# Altium schematic sheet CPU_Peripherals.SchDoc
size 594 x 420 mm; SheetNumber: 11; SheetTotal: 16
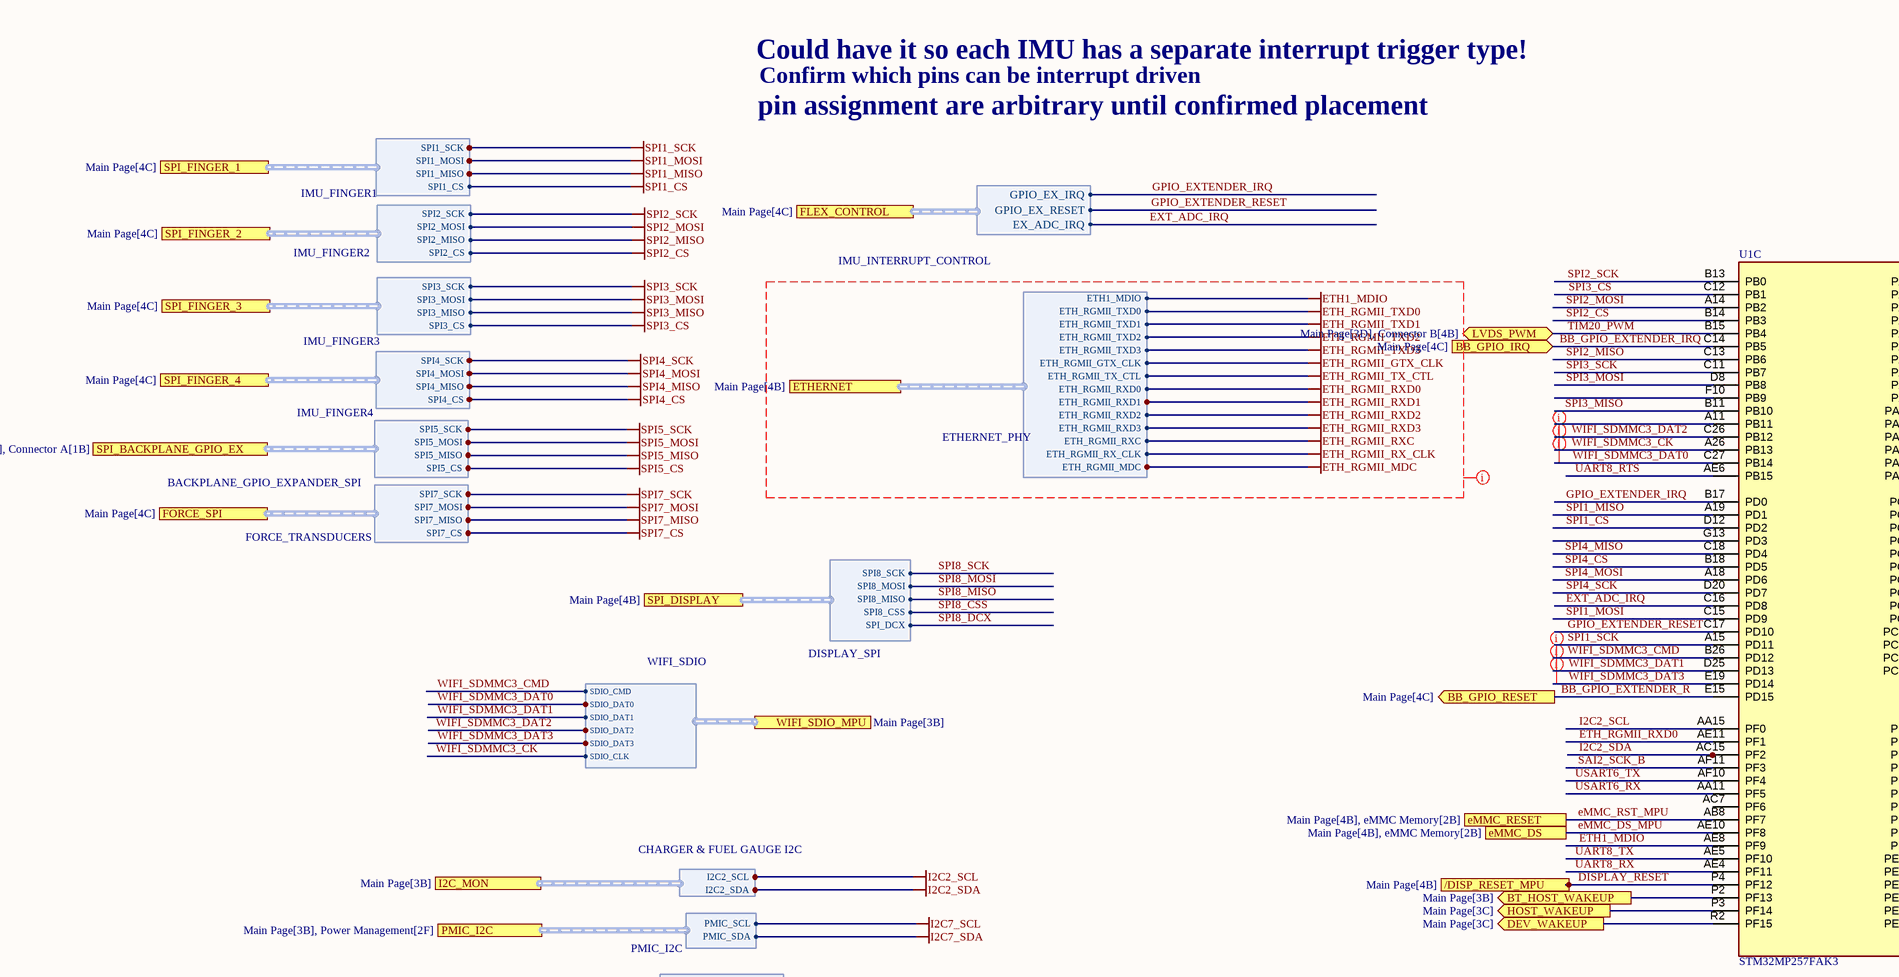
[diagram p0: CPU_Peripherals.SchDoc, top left]
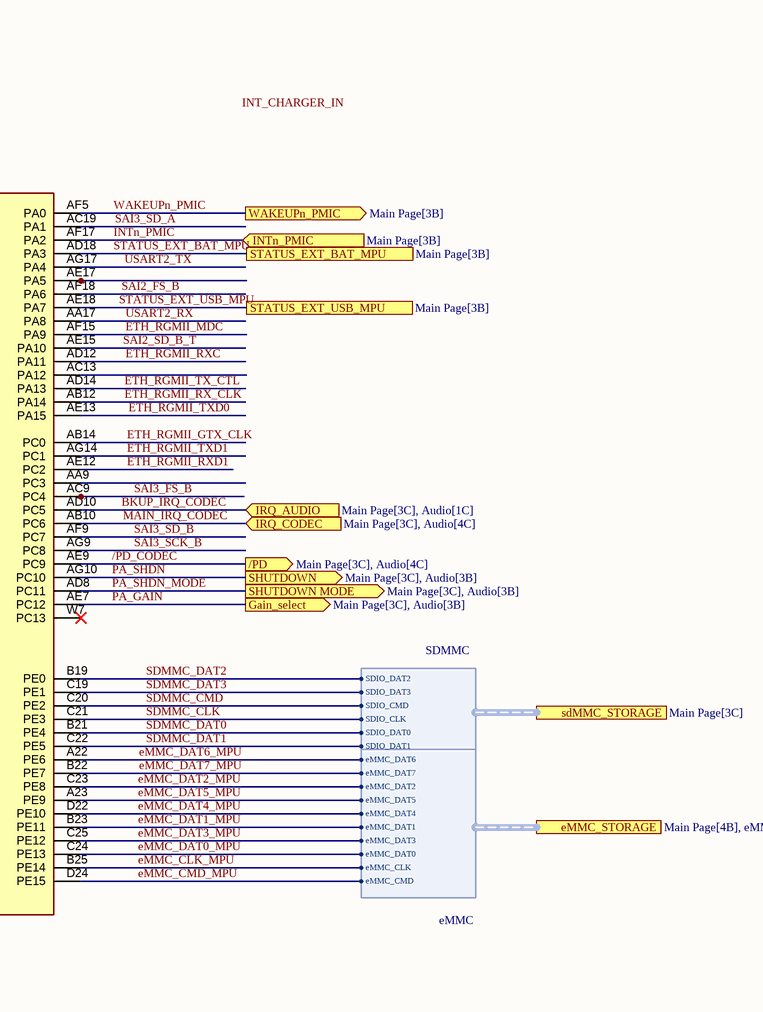
[diagram p1: CPU_Peripherals.SchDoc, top right]
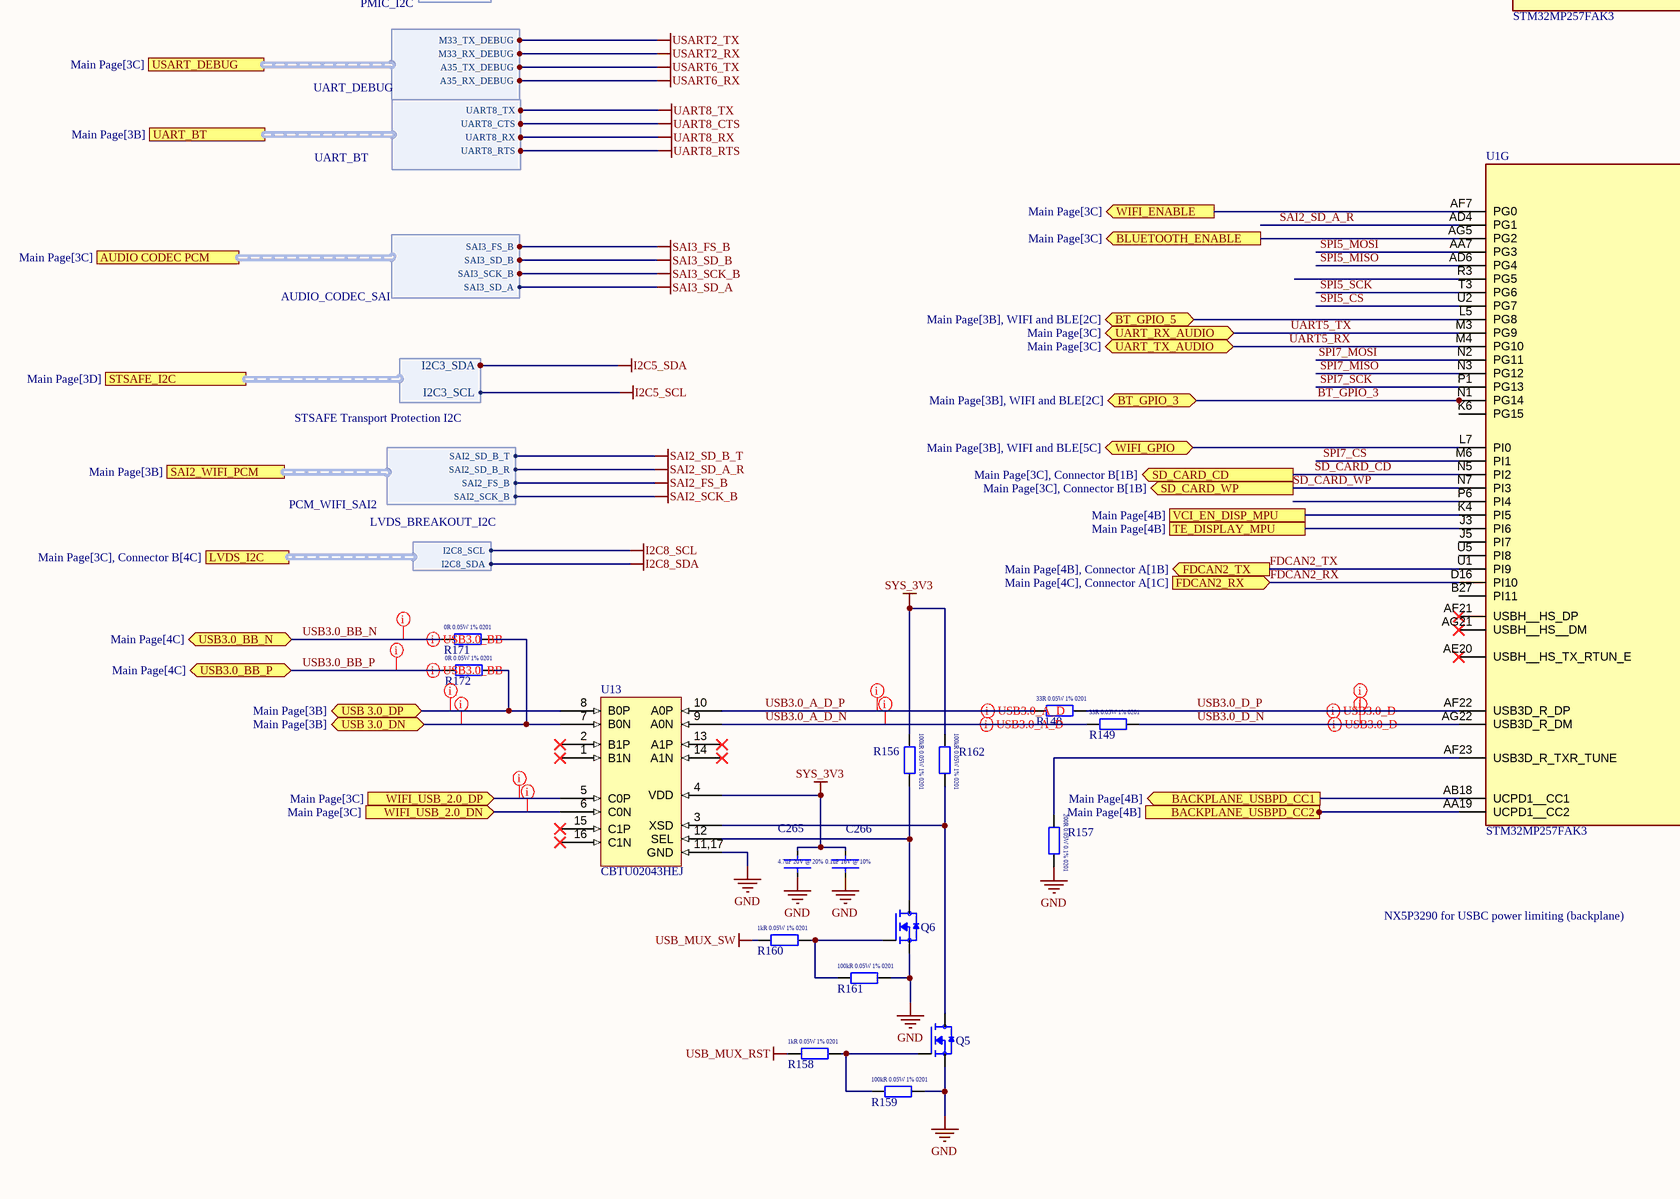
[diagram p2: CPU_Peripherals.SchDoc, bottom left]
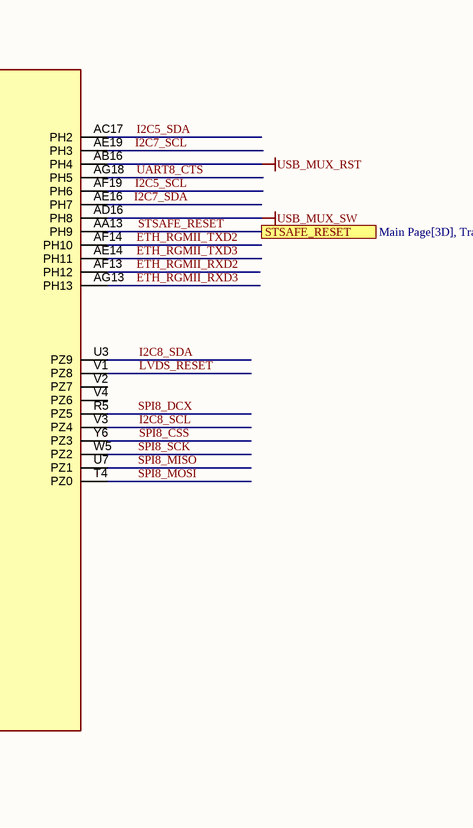
[diagram p3: CPU_Peripherals.SchDoc, bottom right]

## Parts
C265  4.7uF  [CAPC1005X06L]  (value not drawn)
C266  0.1uF  [CAPC0603X03L]  (value not drawn)
Q5  SSM3K15ACT,L3F  [SSM3K15ACT]  (value not drawn)
Q6  SSM3K15ACT,L3F  [SSM3K15ACT]  (value not drawn)
R148  ERJ-1GNF33R0C  [RESC0603X03L]  (value not drawn)
R149  ERJ-1GNF33R0C  [RESC0603X03L]  (value not drawn)
R156  ERJ-1GNF1003C  [RESC0603X03L]  (value not drawn)
R157  ERA-1AEB201C  [RESC0603X03L]  (value not drawn)
R158  ERJ-1GNF1001C  [RESC0603X03L]  (value not drawn)
R159  ERJ-1GNF1003C  [RESC0603X03L]  (value not drawn)
R160  ERJ-1GNF1001C  [RESC0603X03L]  (value not drawn)
R161  ERJ-1GNF1003C  [RESC0603X03L]  (value not drawn)
R162  ERJ-1GNF1003C  [RESC0603X03L]  (value not drawn)
R171  ERJ-1GN0R00C  [RESC0603X03L]  (value not drawn)
R172  ERJ-1GN0R00C  [RESC0603X03L]  (value not drawn)
U1  STM32MP257FAK3  [STM32MP257FAK3]  (parts C,G of 7)
U13  CBTU02043HEJ  [CBTU02043HEJ]

## Ports
/DISP_RESET_MPU (out, see Main Page[4B]), /PD (out, see Main Page[3C], Audio[4C]), AUDIO CODEC PCM (harness AUDIO_CODEC_SAI, see Main Page[3C]), BACKPLANE_USBPD_CC1 (out, see Main Page[4B]), BACKPLANE_USBPD_CC2 (out, see Main Page[4B]), BB_GPIO_IRQ (in, see Main Page[4C]), BB_GPIO_RESET (out, see Main Page[4C]), BLUETOOTH_ENABLE (out, see Main Page[3C]), BT_GPIO_3 (bidir, see Main Page[3B], WIFI and BLE[2C]), BT_GPIO_5 (bidir, see Main Page[3B], WIFI and BLE[2C]), BT_HOST_WAKEUP (out, see Main Page[3B]), DEV_WAKEUP (out, see Main Page[3C]), eMMC_DS (see Main Page[4B], eMMC Memory[2B]), eMMC_RESET (see Main Page[4B], eMMC Memory[2B]), eMMC_STORAGE (harness eMMC, see Main Page[4B], eMMC Memory[1B]), ETHERNET (harness ETHERNET_PHY, see Main Page[4B]), FDCAN2_RX (in, see Main Page[4C], Connector A[1C]), FDCAN2_TX (out, see Main Page[4B], Connector A[1B]), FLEX_CONTROL (harness IMU_INTERRUPT_CONTROL, see Main Page[4C]), FORCE_SPI (harness FORCE_TRANSDUCERS, see Main Page[4C]), Gain_select (out, see Main Page[3C], Audio[3B]), HOST_WAKEUP (out, see Main Page[3C]), I2C_MON (harness CHARGER & FUEL GAUGE I2C, see Main Page[3B]), INTn_PMIC (in, see Main Page[3B]), IRQ_AUDIO (in, see Main Page[3C], Audio[1C]), IRQ_CODEC (in, see Main Page[3C], Audio[4C]), LVDS_I2C (harness LVDS_BREAKOUT_I2C, see Main Page[3C], Connector B[4C]), LVDS_PWM (bidir, see Main Page[3D], Connector B[4B]), PMIC_I2C (harness PMIC_I2C, see Main Page[3B], Power Management[2F]), SAI2_WIFI_PCM (harness PCM_WIFI_SAI2, see Main Page[3B]), SD_CARD_CD (out, see Main Page[3C], Connector B[1B]), SD_CARD_WP (out, see Main Page[3C], Connector B[1B]), sdMMC_STORAGE (harness SDMMC, see Main Page[3C]), SHUTDOWN (out, see Main Page[3C], Audio[3B]), SHUTDOWN MODE (out, see Main Page[3C], Audio[3B]), SPI_BACKPLANE_GPIO_EX (harness BACKPLANE_GPIO_EXPANDER_SPI, see Main Page[4B], Connector A[1B]), SPI_DISPLAY (harness DISPLAY_SPI, see Main Page[4B]), SPI_FINGER_1 (harness IMU_FINGER1, see Main Page[4C]), SPI_FINGER_2 (harness IMU_FINGER2, see Main Page[4C]), SPI_FINGER_3 (harness IMU_FINGER3, see Main Page[4C]), SPI_FINGER_4 (harness IMU_FINGER4, see Main Page[4C]), STATUS_EXT_BAT_MPU (see Main Page[3B]), STATUS_EXT_USB_MPU (see Main Page[3B]), STSAFE_I2C (harness STSAFE Transport Protection I2C, see Main Page[3D]), STSAFE_RESET (see Main Page[3D], Transport Layer Security[3B]), TE_DISPLAY_MPU (see Main Page[4B]), UART_BT (harness UART_BT, see Main Page[3B]), UART_RX_AUDIO (bidir, see Main Page[3C]), UART_TX_AUDIO (bidir, see Main Page[3C]), USART_DEBUG (harness UART_DEBUG, see Main Page[3C]), USB3.0_BB_N (bidir, see Main Page[4C]), USB3.0_BB_P (bidir, see Main Page[4C]), USB 3.0_DN (bidir, see Main Page[3B]), USB 3.0_DP (bidir, see Main Page[3B]), VCI_EN_DISP_MPU (see Main Page[4B]), WAKEUPn_PMIC (out, see Main Page[3B]), WIFI_ENABLE (out, see Main Page[3C]), WIFI_GPIO (bidir, see Main Page[3B], WIFI and BLE[5C]), WIFI_SDIO_MPU (harness WIFI_SDIO, see Main Page[3B]), WIFI_USB_2.0_DN (in, see Main Page[3C]), WIFI_USB_2.0_DP (in, see Main Page[3C])

## Harnesses
eMMC: eMMC_CLK, eMMC_CMD, eMMC_DAT0, eMMC_DAT1, eMMC_DAT2, eMMC_DAT3, eMMC_DAT4, eMMC_DAT5, eMMC_DAT6, eMMC_DAT7
SDMMC: SDIO_DAT2, SDIO_DAT3, SDIO_DAT0, SDIO_DAT1, SDIO_CMD, SDIO_CLK
WIFI_SDIO: SDIO_DAT2, SDIO_DAT3, SDIO_DAT0, SDIO_DAT1, SDIO_CMD, SDIO_CLK
UART_DEBUG: M33_TX_DEBUG, M33_RX_DEBUG, A35_TX_DEBUG, A35_RX_DEBUG
UART_BT: UART8_TX, UART8_CTS, UART8_RX, UART8_RTS
ETHERNET_PHY: ETH_RGMII_GTX_CLK, ETH_RGMII_TX_CTL, ETH_RGMII_RXD0, ETH_RGMII_RXD1, ETH_RGMII_TXD0, ETH_RGMII_TXD1, ETH_RGMII_TXD2, ETH_RGMII_TXD3, ETH_RGMII_RXD2, ETH_RGMII_RXD3, ETH_RGMII_RXC, ETH_RGMII_RX_CLK, ETH_RGMII_MDC, ETH1_MDIO
AUDIO_CODEC_SAI: SAI3_FS_B, SAI3_SD_B, SAI3_SCK_B, SAI3_SD_A
IMU_FINGER1: SPI1_SCK, SPI1_MOSI, SPI1_MISO, SPI1_CS
IMU_FINGER2: SPI2_SCK, SPI2_MOSI, SPI2_MISO, SPI2_CS
IMU_FINGER3: SPI3_SCK, SPI3_MOSI, SPI3_MISO, SPI3_CS
IMU_FINGER4: SPI4_SCK, SPI4_MOSI, SPI4_MISO, SPI4_CS
BACKPLANE_GPIO_EXPANDER_SPI: SPI5_SCK, SPI5_MOSI, SPI5_MISO, SPI5_CS
FORCE_TRANSDUCERS: SPI7_SCK, SPI7_MOSI, SPI7_MISO, SPI7_CS
CHARGER & FUEL GAUGE I2C: I2C2_SCL, I2C2_SDA
PCM_WIFI_SAI2: SAI2_SD_B_R, SAI2_FS_B, SAI2_SCK_B, SAI2_SD_B_T
DISPLAY_SPI: SPI8_SCK, SPI8_MOSI, SPI8_MISO, SPI_DCX, SPI8_CSS
PMIC_I2C: PMIC_SCL, PMIC_SDA
STSAFE Transport Protection I2C: I2C3_SCL, I2C3_SDA
LVDS_BREAKOUT_I2C: I2C8_SCL, I2C8_SDA
IMU_INTERRUPT_CONTROL: GPIO_EX_IRQ, GPIO_EX_RESET, EX_ADC_IRQ

## Nets
ETH1_MDIO: U1.AE8(PF9) ; port ETHERNET.ETH1_MDIO
ETH_RGMII_GTX_CLK: U1.AB14(PC0) ; port ETHERNET.ETH_RGMII_GTX_CLK
ETH_RGMII_MDC: U1.AF15(PA9) ; port ETHERNET.ETH_RGMII_MDC
ETH_RGMII_RX_CLK: U1.AB12(PA14) ; port ETHERNET.ETH_RGMII_RX_CLK
ETH_RGMII_RXC: U1.AD12(PA11) ; port ETHERNET.ETH_RGMII_RXC
ETH_RGMII_RXD0: U1.AE11(PF1) ; port ETHERNET.ETH_RGMII_RXD0
ETH_RGMII_RXD1: U1.AE12(PC2) ; port ETHERNET.ETH_RGMII_RXD1
ETH_RGMII_RXD2: U1.AF13(PH12) ; port ETHERNET.ETH_RGMII_RXD2
ETH_RGMII_RXD3: U1.AG13(PH13) ; port ETHERNET.ETH_RGMII_RXD3
ETH_RGMII_TX_CTL: U1.AD14(PA13) ; port ETHERNET.ETH_RGMII_TX_CTL
ETH_RGMII_TXD0: U1.AE13(PA15) ; port ETHERNET.ETH_RGMII_TXD0
ETH_RGMII_TXD1: U1.AG14(PC1) ; port ETHERNET.ETH_RGMII_TXD1
ETH_RGMII_TXD2: U1.AF14(PH10) ; port ETHERNET.ETH_RGMII_TXD2
ETH_RGMII_TXD3: U1.AE14(PH11) ; port ETHERNET.ETH_RGMII_TXD3
GND: C265.1 C266.1 Q5.3(S) Q6.3(S) R157.2 R159.2 R161.2 U13.11,17(GND)
I2C2_SCL: U1.AA15(PF0) ; port I2C_MON.I2C2_SCL
I2C2_SDA: U1.AC15(PF2) ; port I2C_MON.I2C2_SDA
I2C5_SCL: U1.AF19(PH6) ; port STSAFE_I2C.I2C3_SCL
I2C5_SDA: U1.AC17(PH2) ; port STSAFE_I2C.I2C3_SDA
I2C7_SCL: U1.AE19(PH3) ; port PMIC_I2C.PMIC_SCL
I2C7_SDA: U1.AE16(PH7) ; port PMIC_I2C.PMIC_SDA
I2C8_SCL: U1.V3(PZ4) ; port LVDS_I2C.I2C8_SCL
I2C8_SDA: U1.U3(PZ9) ; port LVDS_I2C.I2C8_SDA
SAI2_FS_B: U1.AF18(PA6) ; port SAI2_WIFI_PCM.SAI2_FS_B
SAI2_SCK_B: U1.AF11(PF3) ; port SAI2_WIFI_PCM.SAI2_SCK_B
SAI2_SD_A_R: U1.AD4(PG1) ; port SAI2_WIFI_PCM.SAI2_SD_B_R
SAI2_SD_B_T: U1.AE15(PA10) ; port SAI2_WIFI_PCM.SAI2_SD_B_T
SAI3_FS_B: U1.AC9(PC4) ; port AUDIO CODEC PCM.SAI3_FS_B
SAI3_SCK_B: U1.AG9(PC8) ; port AUDIO CODEC PCM.SAI3_SCK_B
SAI3_SD_A: U1.AC19(PA1) ; port AUDIO CODEC PCM.SAI3_SD_A
SAI3_SD_B: U1.AF9(PC7) ; port AUDIO CODEC PCM.SAI3_SD_B
SPI1_CS: U1.D12(PD2) ; port SPI_FINGER_1.SPI1_CS
SPI1_MISO: U1.A19(PD1) ; port SPI_FINGER_1.SPI1_MISO
SPI1_MOSI: U1.C15(PD9) ; port SPI_FINGER_1.SPI1_MOSI
SPI1_SCK: U1.A15(PD11) ; port SPI_FINGER_1.SPI1_SCK
SPI2_CS: U1.B14(PB3) ; port SPI_FINGER_2.SPI2_CS
SPI2_MISO: U1.C13(PB6) ; port SPI_FINGER_2.SPI2_MISO
SPI2_MOSI: U1.A14(PB2) ; port SPI_FINGER_2.SPI2_MOSI
SPI2_SCK: U1.B13(PB0) ; port SPI_FINGER_2.SPI2_SCK
SPI3_CS: U1.C12(PB1) ; port SPI_FINGER_3.SPI3_CS
SPI3_MISO: U1.B11(PB10) ; port SPI_FINGER_3.SPI3_MISO
SPI3_MOSI: U1.D8(PB8) ; port SPI_FINGER_3.SPI3_MOSI
SPI3_SCK: U1.C11(PB7) ; port SPI_FINGER_3.SPI3_SCK
SPI4_CS: U1.B18(PD5) ; port SPI_FINGER_4.SPI4_CS
SPI4_MISO: U1.C18(PD4) ; port SPI_FINGER_4.SPI4_MISO
SPI4_MOSI: U1.A18(PD6) ; port SPI_FINGER_4.SPI4_MOSI
SPI4_SCK: U1.D20(PD7) ; port SPI_FINGER_4.SPI4_SCK
SPI5_CS: U1.U2(PG7) ; port SPI_BACKPLANE_GPIO_EX.SPI5_CS
SPI5_MISO: U1.AD6(PG4) ; port SPI_BACKPLANE_GPIO_EX.SPI5_MISO
SPI5_MOSI: U1.AA7(PG3) ; port SPI_BACKPLANE_GPIO_EX.SPI5_MOSI
SPI5_SCK: U1.T3(PG6) ; port SPI_BACKPLANE_GPIO_EX.SPI5_SCK
SPI7_CS: U1.M6(PI1) ; port FORCE_SPI.SPI7_CS
SPI7_MISO: U1.N3(PG12) ; port FORCE_SPI.SPI7_MISO
SPI7_MOSI: U1.N2(PG11) ; port FORCE_SPI.SPI7_MOSI
SPI7_SCK: U1.P1(PG13) ; port FORCE_SPI.SPI7_SCK
SYS_3V3: C265.2 C266.2 R156.1 R162.1 U13.4(VDD)
UART8_CTS: U1.AG18(PH5) ; port UART_BT.UART8_CTS
UART8_RTS: U1.AE6(PB15) ; port UART_BT.UART8_RTS
UART8_RX: U1.AE4(PF11) ; port UART_BT.UART8_RX
UART8_TX: U1.AE5(PF10) ; port UART_BT.UART8_TX
USART2_RX: U1.AA17(PA8) ; port USART_DEBUG.M33_RX_DEBUG
USART2_TX: U1.AG17(PA4) ; port USART_DEBUG.M33_TX_DEBUG
USART6_RX: U1.AA11(PF5) ; port USART_DEBUG.A35_RX_DEBUG
USART6_TX: U1.AF10(PF4) ; port USART_DEBUG.A35_TX_DEBUG
USB_MUX_RST: R158.1 U1.AB16(PH4)
USB_MUX_SW: R160.1 U1.AD16(PH8)
/PD_CODEC: U1.AE9(PC9) ; port /PD
BACKPLANE_USBPD_CC1: U1.AB18(UCPD1__CC1) ; port BACKPLANE_USBPD_CC1
BACKPLANE_USBPD_CC2: U1.AA19(UCPD1__CC2) ; port BACKPLANE_USBPD_CC2
BB_GPIO_EXTENDER_IRQ: U1.C14(PB5) ; port BB_GPIO_IRQ
BB_GPIO_EXTENDER_R: U1.E15(PD15) ; port BB_GPIO_RESET
BKUP_IRQ_CODEC: U1.AD10(PC5) ; port IRQ_AUDIO
BLUETOOTH_ENABLE: U1.AG5(PG2) ; port BLUETOOTH_ENABLE
BT_GPIO_3: U1.N1(PG14) ; port BT_GPIO_3
BT_GPIO_5: U1.L5(PG8) ; port BT_GPIO_5
BT_HOST_WAKEUP: U1.P2(PF13) ; port BT_HOST_WAKEUP
DEV_WAKEUP: U1.R2(PF15) ; port DEV_WAKEUP
DISPLAY_RESET: U1.P4(PF12) ; port /DISP_RESET_MPU
eMMC_CLK_MPU: U1.B25(PE14) ; port eMMC_STORAGE.eMMC_CLK
eMMC_CMD_MPU: U1.D24(PE15) ; port eMMC_STORAGE.eMMC_CMD
eMMC_DAT0_MPU: U1.C24(PE13) ; port eMMC_STORAGE.eMMC_DAT0
eMMC_DAT1_MPU: U1.B23(PE11) ; port eMMC_STORAGE.eMMC_DAT1
eMMC_DAT2_MPU: U1.C23(PE8) ; port eMMC_STORAGE.eMMC_DAT2
eMMC_DAT3_MPU: U1.C25(PE12) ; port eMMC_STORAGE.eMMC_DAT3
eMMC_DAT4_MPU: U1.D22(PE10) ; port eMMC_STORAGE.eMMC_DAT4
eMMC_DAT5_MPU: U1.A23(PE9) ; port eMMC_STORAGE.eMMC_DAT5
eMMC_DAT6_MPU: U1.A22(PE6) ; port eMMC_STORAGE.eMMC_DAT6
eMMC_DAT7_MPU: U1.B22(PE7) ; port eMMC_STORAGE.eMMC_DAT7
eMMC_DS_MPU: U1.AE10(PF8) ; port eMMC_DS
eMMC_RST_MPU: U1.AB8(PF7) ; port eMMC_RESET
EXT_ADC_IRQ: U1.C16(PD8) ; port FLEX_CONTROL.EX_ADC_IRQ
FDCAN2_RX: U1.D16(PI10) ; port FDCAN2_RX
FDCAN2_TX: U1.U1(PI9) ; port FDCAN2_TX
GPIO_EXTENDER_IRQ: U1.B17(PD0) ; port FLEX_CONTROL.GPIO_EX_IRQ
GPIO_EXTENDER_RESET: U1.C17(PD10) ; port FLEX_CONTROL.GPIO_EX_RESET
HOST_WAKEUP: U1.P3(PF14) ; port HOST_WAKEUP
INTn_PMIC: U1.AF17(PA2) ; port INTn_PMIC
LVDS_RESET: U1.V1(PZ8)
MAIN_IRQ_CODEC: U1.AB10(PC6) ; port IRQ_CODEC
PA_GAIN: U1.AE7(PC12) ; port Gain_select
PA_SHDN: U1.AG10(PC10) ; port SHUTDOWN
PA_SHDN_MODE: U1.AD8(PC11) ; port SHUTDOWN MODE
SD_CARD_CD: U1.N5(PI2) ; port SD_CARD_CD
SD_CARD_WP: U1.N7(PI3) ; port SD_CARD_WP
SDMMC_CLK: U1.C21(PE3) ; port sdMMC_STORAGE.SDIO_CLK
SDMMC_CMD: U1.C20(PE2) ; port sdMMC_STORAGE.SDIO_CMD
SDMMC_DAT0: U1.B21(PE4) ; port sdMMC_STORAGE.SDIO_DAT0
SDMMC_DAT1: U1.C22(PE5) ; port sdMMC_STORAGE.SDIO_DAT1
SDMMC_DAT2: U1.B19(PE0) ; port sdMMC_STORAGE.SDIO_DAT2
SDMMC_DAT3: U1.C19(PE1) ; port sdMMC_STORAGE.SDIO_DAT3
SPI8_CSS: U1.Y6(PZ3) ; port SPI_DISPLAY.SPI8_CSS
SPI8_DCX: U1.R5(PZ5) ; port SPI_DISPLAY.SPI_DCX
SPI8_MISO: U1.U7(PZ1) ; port SPI_DISPLAY.SPI8_MISO
SPI8_MOSI: U1.T4(PZ0) ; port SPI_DISPLAY.SPI8_MOSI
SPI8_SCK: U1.W5(PZ2) ; port SPI_DISPLAY.SPI8_SCK
STATUS_EXT_BAT_MPU: U1.AD18(PA3) ; port STATUS_EXT_BAT_MPU
STATUS_EXT_USB_MPU: U1.AE18(PA7) ; port STATUS_EXT_USB_MPU
STSAFE_RESET: U1.AA13(PH9) ; port STSAFE_RESET
TE_DISPLAY_MPU: U1.J3(PI6) ; port TE_DISPLAY_MPU
TIM20_PWM: U1.B15(PB4) ; port LVDS_PWM
UART5_RX: U1.M4(PG10) ; port UART_TX_AUDIO
UART5_TX: U1.M3(PG9) ; port UART_RX_AUDIO
USB3.0_A_D_N: R149.1 U13.9(A0N)
USB3.0_A_D_P: R148.1 U13.10(A0P)
USB3.0_BB_N: R171.1 ; port USB3.0_BB_N
USB3.0_BB_P: R172.1 ; port USB3.0_BB_P
USB3.0_D_N: R149.2 U1.AG22(USB3D_R_DM)
USB3.0_D_P: R148.2 U1.AF22(USB3D_R_DP)
USB 3.0_DN: R171.2 U13.7(B0N) ; port USB 3.0_DN
USB 3.0_DP: R172.2 U13.8(B0P) ; port USB 3.0_DP
VCI_EN_DISP_MPU: U1.K4(PI5) ; port VCI_EN_DISP_MPU
WAKEUPn_PMIC: U1.AF5(PA0) ; port WAKEUPn_PMIC
WIFI_ENABLE: U1.AF7(PG0) ; port WIFI_ENABLE
WIFI_GPIO: U1.L7(PI0) ; port WIFI_GPIO
WIFI_SDMMC3_CK: U1.A26(PB13) ; port WIFI_SDIO_MPU.SDIO_CLK
WIFI_SDMMC3_CMD: U1.B26(PD12) ; port WIFI_SDIO_MPU.SDIO_CMD
WIFI_SDMMC3_DAT0: U1.C27(PB14) ; port WIFI_SDIO_MPU.SDIO_DAT0
WIFI_SDMMC3_DAT1: U1.D25(PD13) ; port WIFI_SDIO_MPU.SDIO_DAT1
WIFI_SDMMC3_DAT2: U1.C26(PB12) ; port WIFI_SDIO_MPU.SDIO_DAT2
WIFI_SDMMC3_DAT3: U1.E19(PD14) ; port WIFI_SDIO_MPU.SDIO_DAT3
WIFI_USB_2.0_DN: U13.6(C0N) ; port WIFI_USB_2.0_DN
WIFI_USB_2.0_DP: U13.5(C0P) ; port WIFI_USB_2.0_DP
NetQ5_1: Q5.1(G) R158.2 R159.1
NetQ5_2: Q5.2(D) R162.2 U13.3(XSD)
NetQ6_1: Q6.1(G) R160.2 R161.1
NetQ6_2: Q6.2(D) R156.2 U13.12(SEL)
NetR157_1: R157.1 U1.AF23(USB3D_R_TXR_TUNE)

Not connected (* = marked no-connect by the designer): U1 A11(PB11) AA9(PC3) AC7(PF6) AC13(PA12) AE17(PA5) AE20(USBH__HS_TX_RTUN_E)* AF21(USBH__HS_DP)* AG21(USBH__HS__DM)* B27(PI11) F10(PB9) G13(PD3) J5(PI7) K6(PG15) P6(PI4) R3(PG5) U5(PI8) V2(PZ7) V4(PZ6) W7(PC13)*; U13 1(B1N)* 2(B1P)* 13(A1P)* 14(A1N)* 15(C1P)* 16(C1N)*

## Layout directives
net class WiFi & BlueTooth: WIFI_SDMMC3_CK, WIFI_SDMMC3_CMD, WIFI_SDMMC3_DAT0, WIFI_SDMMC3_DAT1, WIFI_SDMMC3_DAT2, WIFI_SDMMC3_DAT3
differential pair: USB3.0_A_D_N, USB3.0_A_D_P, USB3.0_BB_N, USB3.0_BB_P, USB3.0_D_N, USB3.0_D_P
net class Ethernet: ETH1_MDIO, ETH_RGMII_GTX_CLK, ETH_RGMII_MDC, ETH_RGMII_RX_CLK, ETH_RGMII_RXC, ETH_RGMII_RXD0, ETH_RGMII_RXD1, ETH_RGMII_RXD2, ETH_RGMII_RXD3, ETH_RGMII_TX_CTL, ETH_RGMII_TXD0, ETH_RGMII_TXD1, ETH_RGMII_TXD2, ETH_RGMII_TXD3
net class High Speed Digital: USB3.0_A_D_N, USB3.0_A_D_P, USB3.0_BB_N, USB3.0_BB_P, USB3.0_D_N, USB3.0_D_P, USB 3.0_DN, USB 3.0_DP, WIFI_USB_2.0_DN, WIFI_USB_2.0_DP

## Notes on the sheet
- Could have it so each IMU has a separate interrupt trigger type!
- Confirm which pins can be interrupt driven
- pin assignment are arbitrary until confirmed placement
- NX5P3290 for USBC power limiting (backplane)
- Labels drawn without touching a wire or pin: INT_CHARGER_IN
- DWG NO:
- REV:
- THIS DOCUMENT AND THE DATA DISCLOSED HEREIN OR
- HEREWITH IS THE PROPERTY OF ALTIUM LIMITED AND MAY
- BE FREELY DISTRIBUTED IN WHOLE. NO RIGHTS ARE
- RESERVED OR EXPRESS OR IMPLIED WARANTEE GIVEN.
- REVISION
- DESCRIPTION
- DATE
- APPROVED
- ENG:
- APPROVALS
- PROJECT
- DSN:
- CHK:
- REFERENCE DOCUMENTS
- PROJECT REVISION:
- TITLE
- DOCUMENT REVISION:
- DESIGN ITEM:
- BOM:
- FAB DWG:
- PCB DWG:
- ASSY DWG:
- SCALE:
- A2
- SIZE
- CAGE CODE
- FILE NAME
- DWG NO.
- SHEET
- OF
- REV
- (in symbol CL05A475MO5NUNC) 4.7uF 20V @ 20%
- (in symbol ERA-1AEB201C) 200R 0.05W 0.1% 0201
- (in symbol ERJ-1GN0R00C) 0R 0.05W 1% 0201
- (in symbol ERJ-1GNF33R0C) 33R 0.05W 1% 0201
- (in symbol ERJ-1GNF1001C) 1kR 0.05W 1% 0201
- (in symbol ERJ-1GNF1003C) 100kR 0.05W 1% 0201
- (in symbol GRM033R61E104KE14J) 0.1uF 16V @ 10%

## Library data of the parts
C265 = CL05A475MO5NUNC: 4.7 µF ±20% 16V Ceramic Capacitor X5R 0402 (1005 Metric)
C266 = GRM033R61E104KE14J: 0.1 µF ±10% 25V Ceramic Capacitor X5R 0201 (0603 Metric)0.1 µF ±10% 25V Ceramic Capacitor X5R 0201 (0603 Metric)
Q5 Q6 = SSM3K15ACT,L3F: N-Channel 30 V 100mA (Ta) 100mW (Ta) Surface Mount CST3; ComponentLink1Description: New link; ComponentLink1URL: https://www.digikey.com.au/en/products/detail/toshiba-semiconductor-and-storage/SSM3K15ACT-L3F/5298026
R148 R149 = ERJ-1GNF33R0C: 33 Ohms ±1% 0.05W, 1/20W Chip Resistor 0201 (0603 Metric) Thick Film; ComponentLink1Description: New link; ComponentLink1URL: https://www.digikey.com.au/en/products/detail/panasonic-electronic-components/ERJ-1GNF33R0C/2035941; Supplier 1: Mouser; Supplier Part Number 1: 667-ERJ-1GNF33R0C
R156 R159 R161 R162 = ERJ-1GNF1003C: 100 kOhms ±1% 0.05W, 1/20W Chip Resistor 0201 (0603 Metric) Thick Film; ComponentLink1Description: New link; ComponentLink1URL: https://www.digikey.com.au/en/products/detail/panasonic-electronic-components/ERJ-1GNF1003C/2036340
R157 = ERA-1AEB201C: 200 Ohms ±0.1% 0.05W, 1/20W Chip Resistor 0201 (0603 Metric) Automotive AEC-Q200 Thin Film; ComponentLink1Description: New link; ComponentLink1URL: https://www.digikey.com.au/en/products/detail/panasonic-electronic-components/ERA-1AEB201C/5035575
R158 R160 = ERJ-1GNF1001C: 1 kOhms ±1% 0.05W, 1/20W Chip Resistor 0201 (0603 Metric) Thick Film
R171 R172 = ERJ-1GN0R00C: 0 Ohms Jumper Chip Resistor 0201 (0603 Metric) Thick Film; ComponentLink1Description: New link; ComponentLink1URL: https://www.digikey.com.au/en/products/detail/panasonic-electronic-components/ERJ-1GN0R00C/3982613; Supplier 1: Mouser; Supplier Part Number 1: 667-ERJ-1GN0R00C
U1 = STM32MP257FAK3: Integrated Circuit; Manufacturer_Name: STMicroelectronics; Datasheet Link: https://www.digikey.ph/en/products/detail/stmicroelectronics/STM32MP257FAK3/24883094; Height: 1mm; Manufacturer_Part_Number: STM32MP257FAK3; Mouser Part Number: 511-STM32MP257FAK3; Mouser Price/Stock: https://www.mouser.co.uk/ProductDetail/STMicroelectronics/STM32MP257FAK3?qs=i8QVZAFTkqQulHX8Hxkfng%3D%3D; Arrow Part Number: STM32MP257FAK3; Arrow Price/Stock: https://www.arrow.com/en/products/stm32mp257fak3/stmicroelectronics?utm_currency=USD&region=nac
U13 = CBTU02043HEJ: USB Switch IC 2 Channel 16-HUQFN (1.6x2.4); Supplier 1: Arrow Electronics; Supplier Part Number 1: CBTU02043HEJ